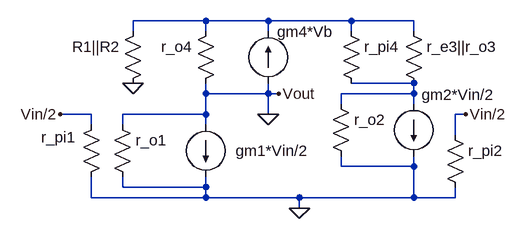
[diagram p0: schematic Draft1.asc]
Draft1.asc, the LTspice schematic file:
Version 4
SHEET 1 880 680
WIRE 176 -176 64 -176
WIRE 272 -176 176 -176
WIRE 400 -176 272 -176
WIRE 496 -176 400 -176
WIRE 64 -160 64 -176
WIRE 176 -160 176 -176
WIRE 272 -160 272 -176
WIRE 400 -160 400 -176
WIRE 496 -160 496 -176
WIRE 496 -80 400 -80
WIRE 176 -64 176 -80
WIRE 272 -64 272 -80
WIRE 272 -64 176 -64
WIRE 288 -64 272 -64
WIRE 496 -64 496 -80
WIRE 496 -64 384 -64
WIRE 384 -48 384 -64
WIRE 496 -48 496 -64
WIRE 0 -32 -48 -32
WIRE 176 -32 176 -64
WIRE 176 -32 48 -32
WIRE 272 -32 272 -64
WIRE 576 -32 560 -32
WIRE 0 -16 0 -32
WIRE 48 -16 48 -32
WIRE 176 -16 176 -32
WIRE 560 0 560 -32
WIRE 384 48 384 32
WIRE 496 48 496 32
WIRE 496 48 384 48
WIRE 48 80 48 64
WIRE 176 80 176 64
WIRE 176 80 48 80
WIRE 0 96 0 64
WIRE 176 96 176 80
WIRE 176 96 0 96
WIRE 320 96 176 96
WIRE 496 96 496 48
WIRE 496 96 320 96
WIRE 560 96 560 80
WIRE 560 96 496 96
WIRE 320 112 320 96
FLAG 320 112 0
FLAG 64 -80 0
FLAG 272 -32 0
FLAG 288 -64 Vout
FLAG -48 -32 Vin/2
FLAG 576 -32 Vin/2
SYMBOL res 16 -32 M0
WINDOW 0 39 35 Left 2
SYMATTR InstName r_pi1
SYMATTR Value ""
SYMBOL res 32 -32 R0
WINDOW 3 36 68 Left 2
SYMATTR InstName r_o1
SYMATTR Value ""
SYMBOL res 192 -176 M0
WINDOW 3 36 68 Left 2
SYMATTR InstName r_o4
SYMATTR Value ""
SYMBOL res 384 -176 R0
SYMATTR InstName r_pi4
SYMATTR Value ""
SYMBOL res 480 -176 R0
SYMATTR InstName r_e3||r_o3
SYMATTR Value ""
SYMBOL current 176 -16 R0
WINDOW 0 46 40 Left 2
SYMATTR InstName gm1*Vin/2
SYMATTR Value ""
SYMBOL current 272 -80 M180
WINDOW 0 14 79 Left 2
WINDOW 3 24 0 Left 2
SYMATTR InstName gm4*Vb
SYMATTR Value ""
SYMBOL current 496 -48 R0
WINDOW 0 12 -14 Left 2
SYMATTR InstName gm2*Vin/2
SYMATTR Value ""
SYMBOL res 368 -64 R0
SYMATTR InstName r_o2
SYMATTR Value ""
SYMBOL res 544 -16 R0
SYMATTR InstName r_pi2
SYMATTR Value ""
SYMBOL res 80 -176 M0
SYMATTR InstName R1||R2
SYMATTR Value ""

The netlist it stands for:
* Draft1.asc
r_pi1 Vin/2 0
r_o1 0 0
r_o4 N001 0
r_pi4 N001 N002
r_e3||r_o3 N001 N002
I§gm1*Vin/2 0 0
I§gm4*Vb 0 N001
I§gm2*Vin/2 N002 0
r_o2 N002 0
r_pi2 Vin/2 0
R1||R2 N001 0
.backanno
.end